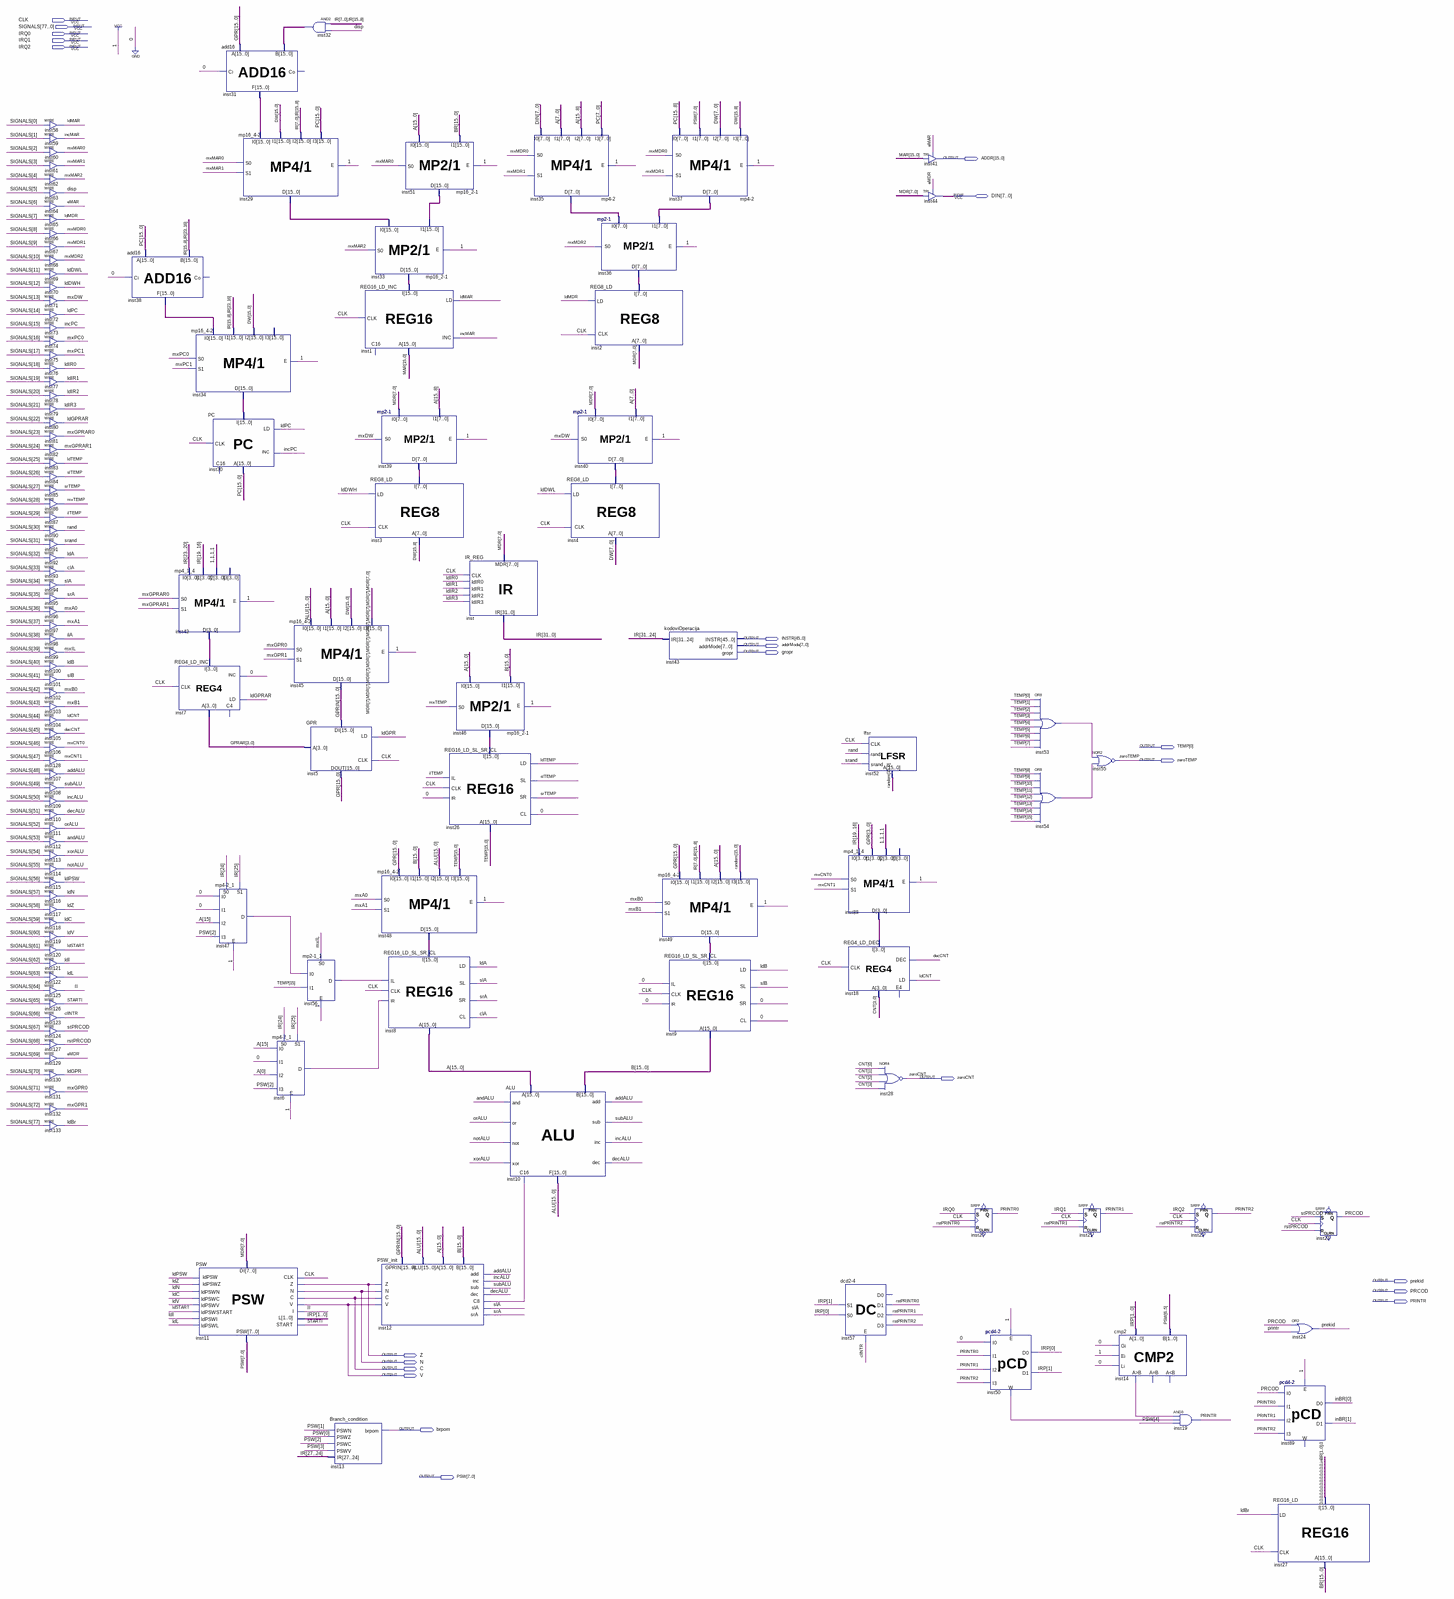
[diagram p0: schematic sheet, whole]
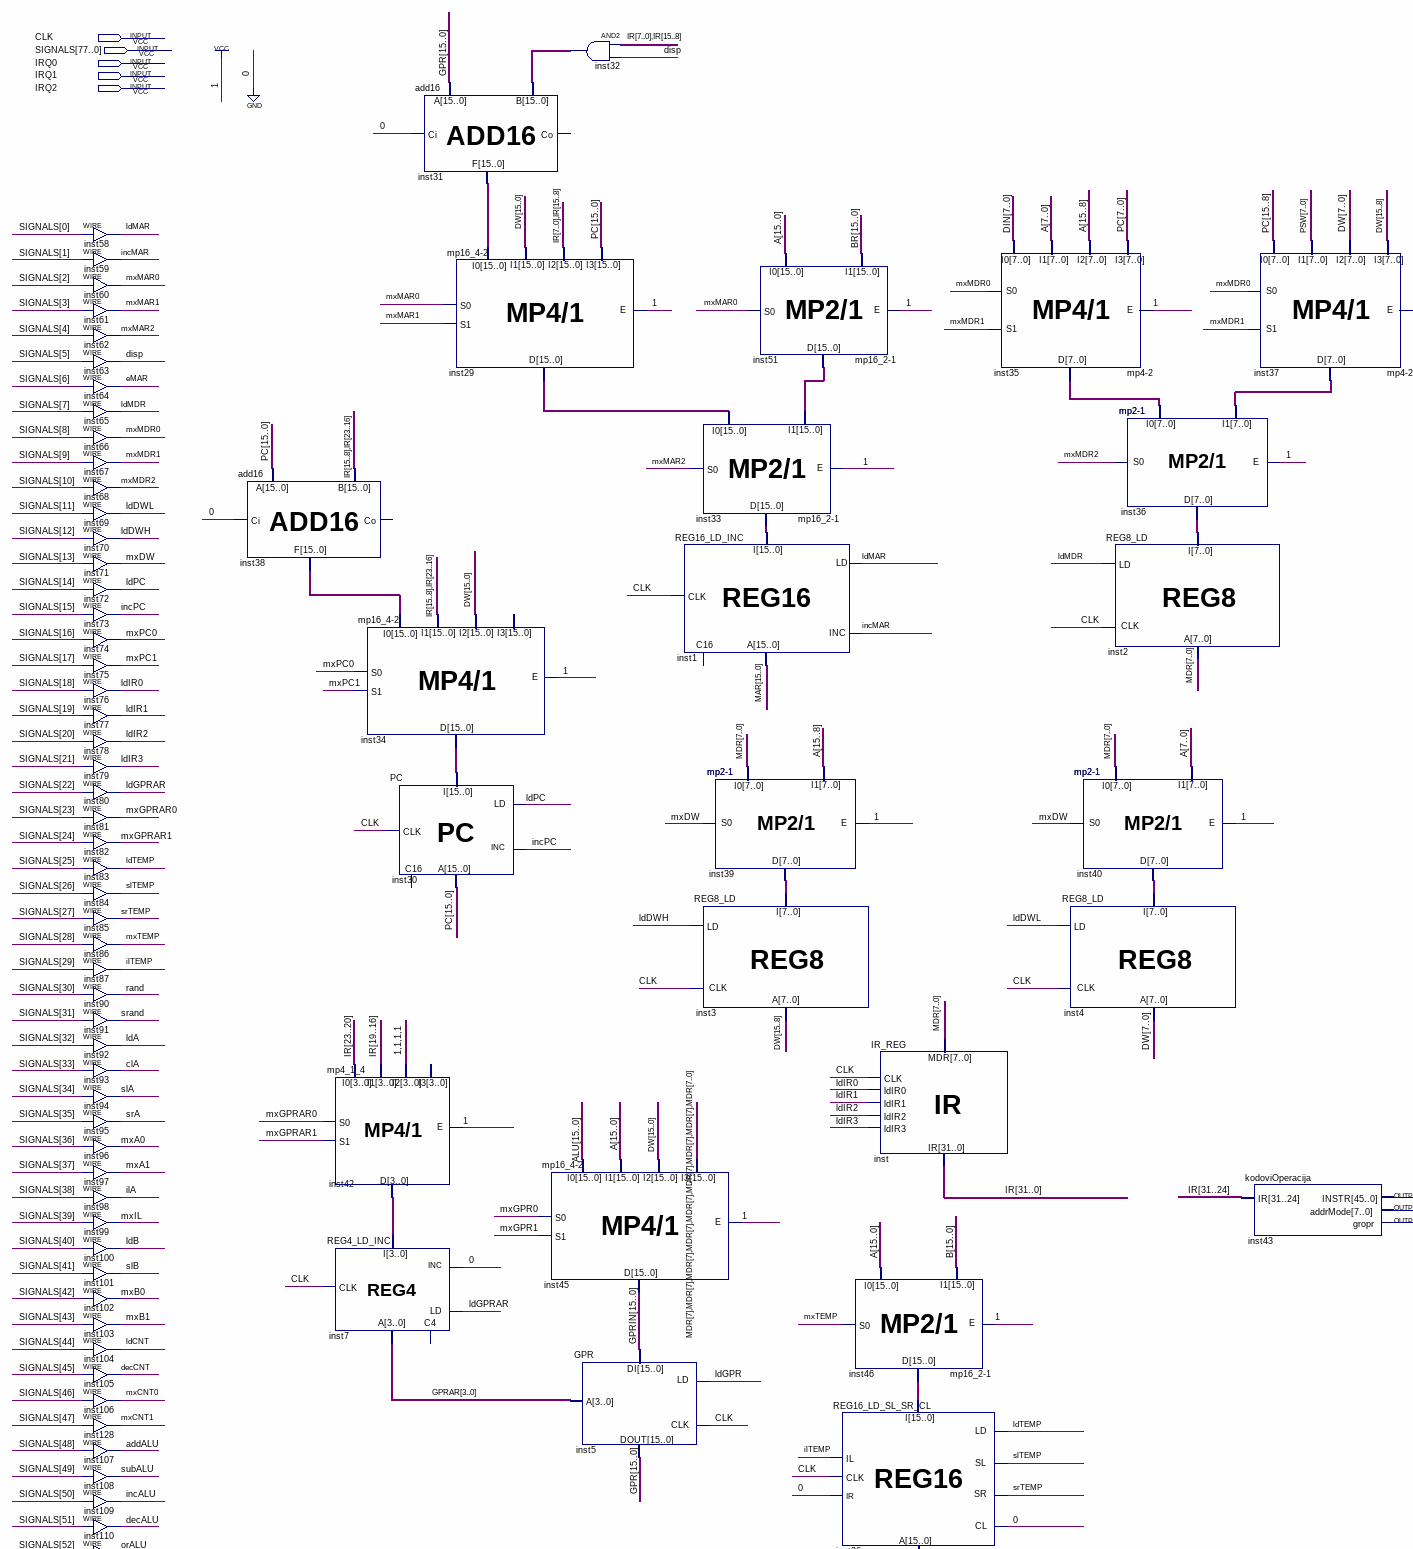
[diagram p1: schematic sheet, upper left part]
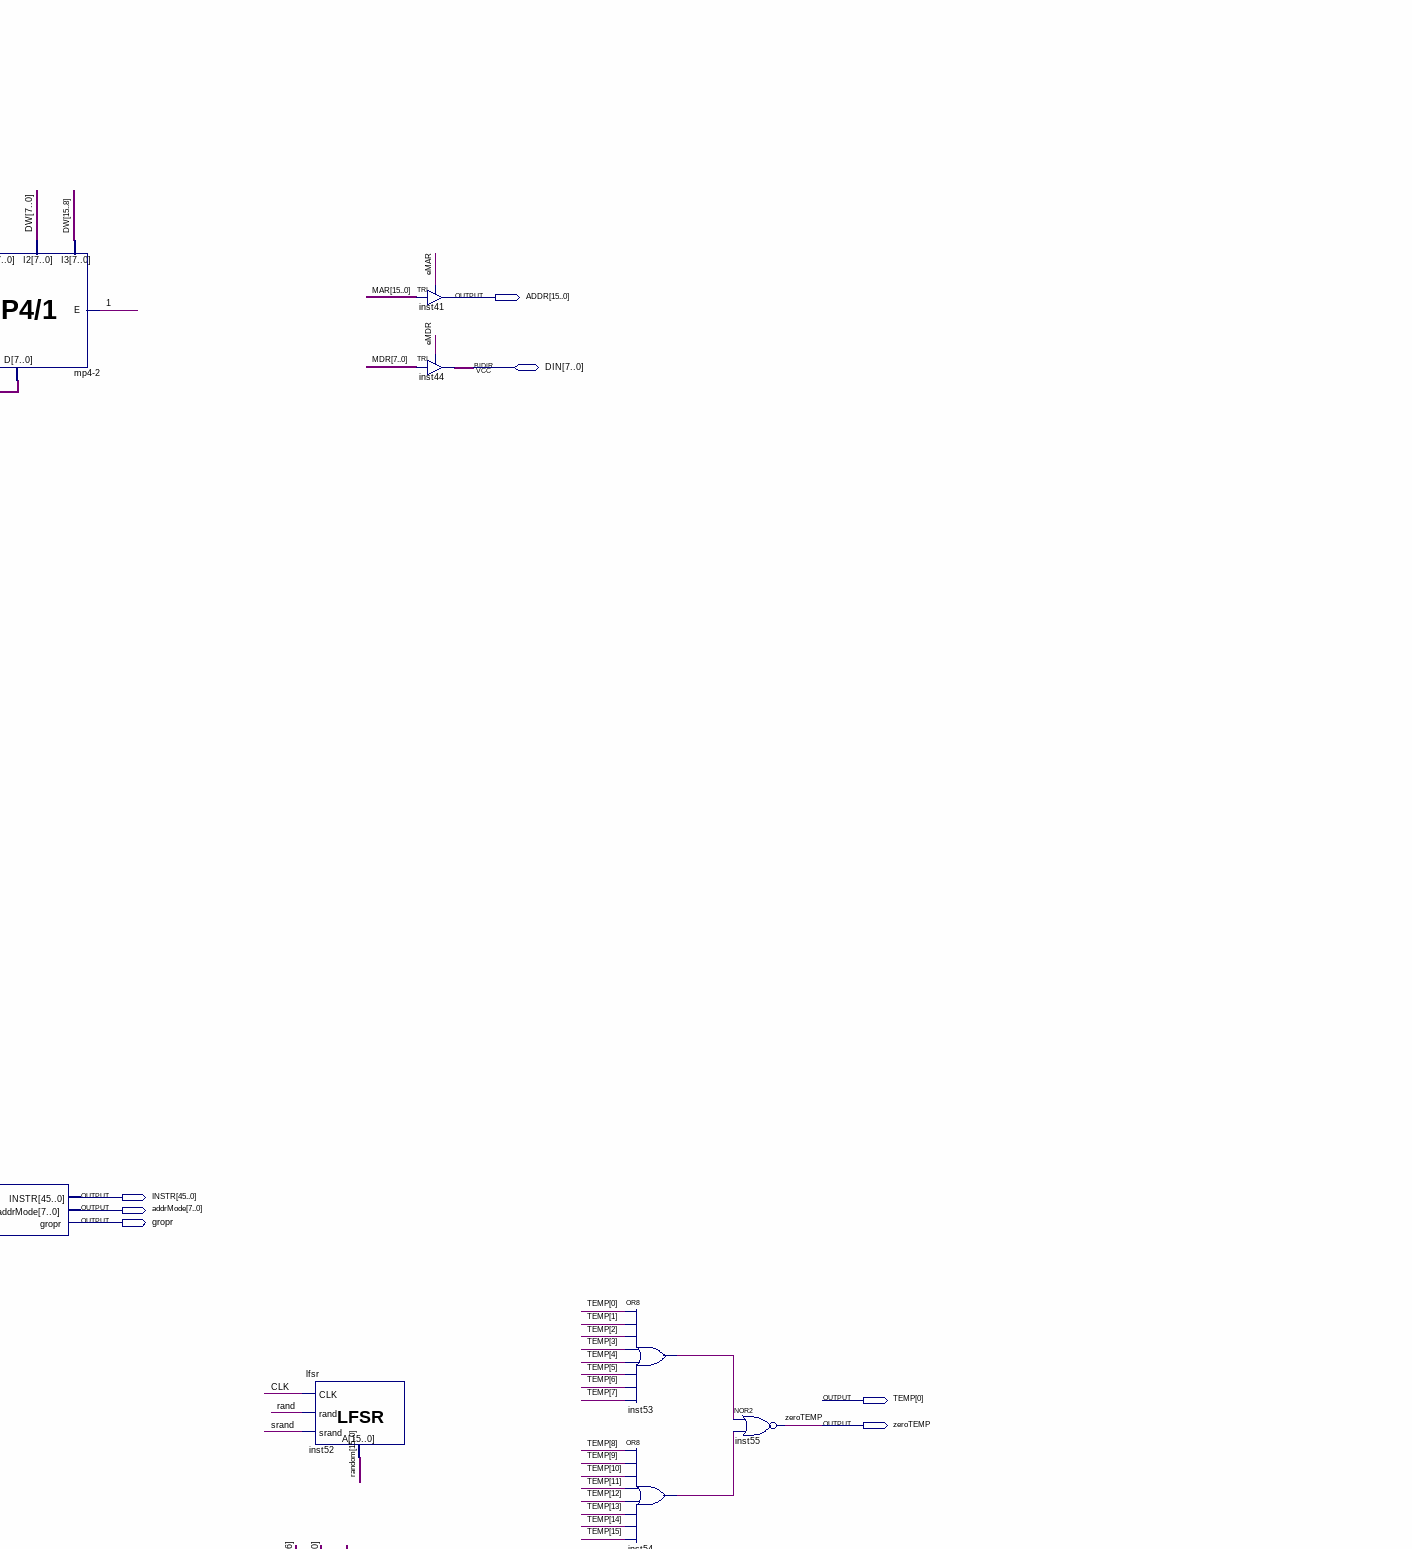
[diagram p2: schematic sheet, upper right part]
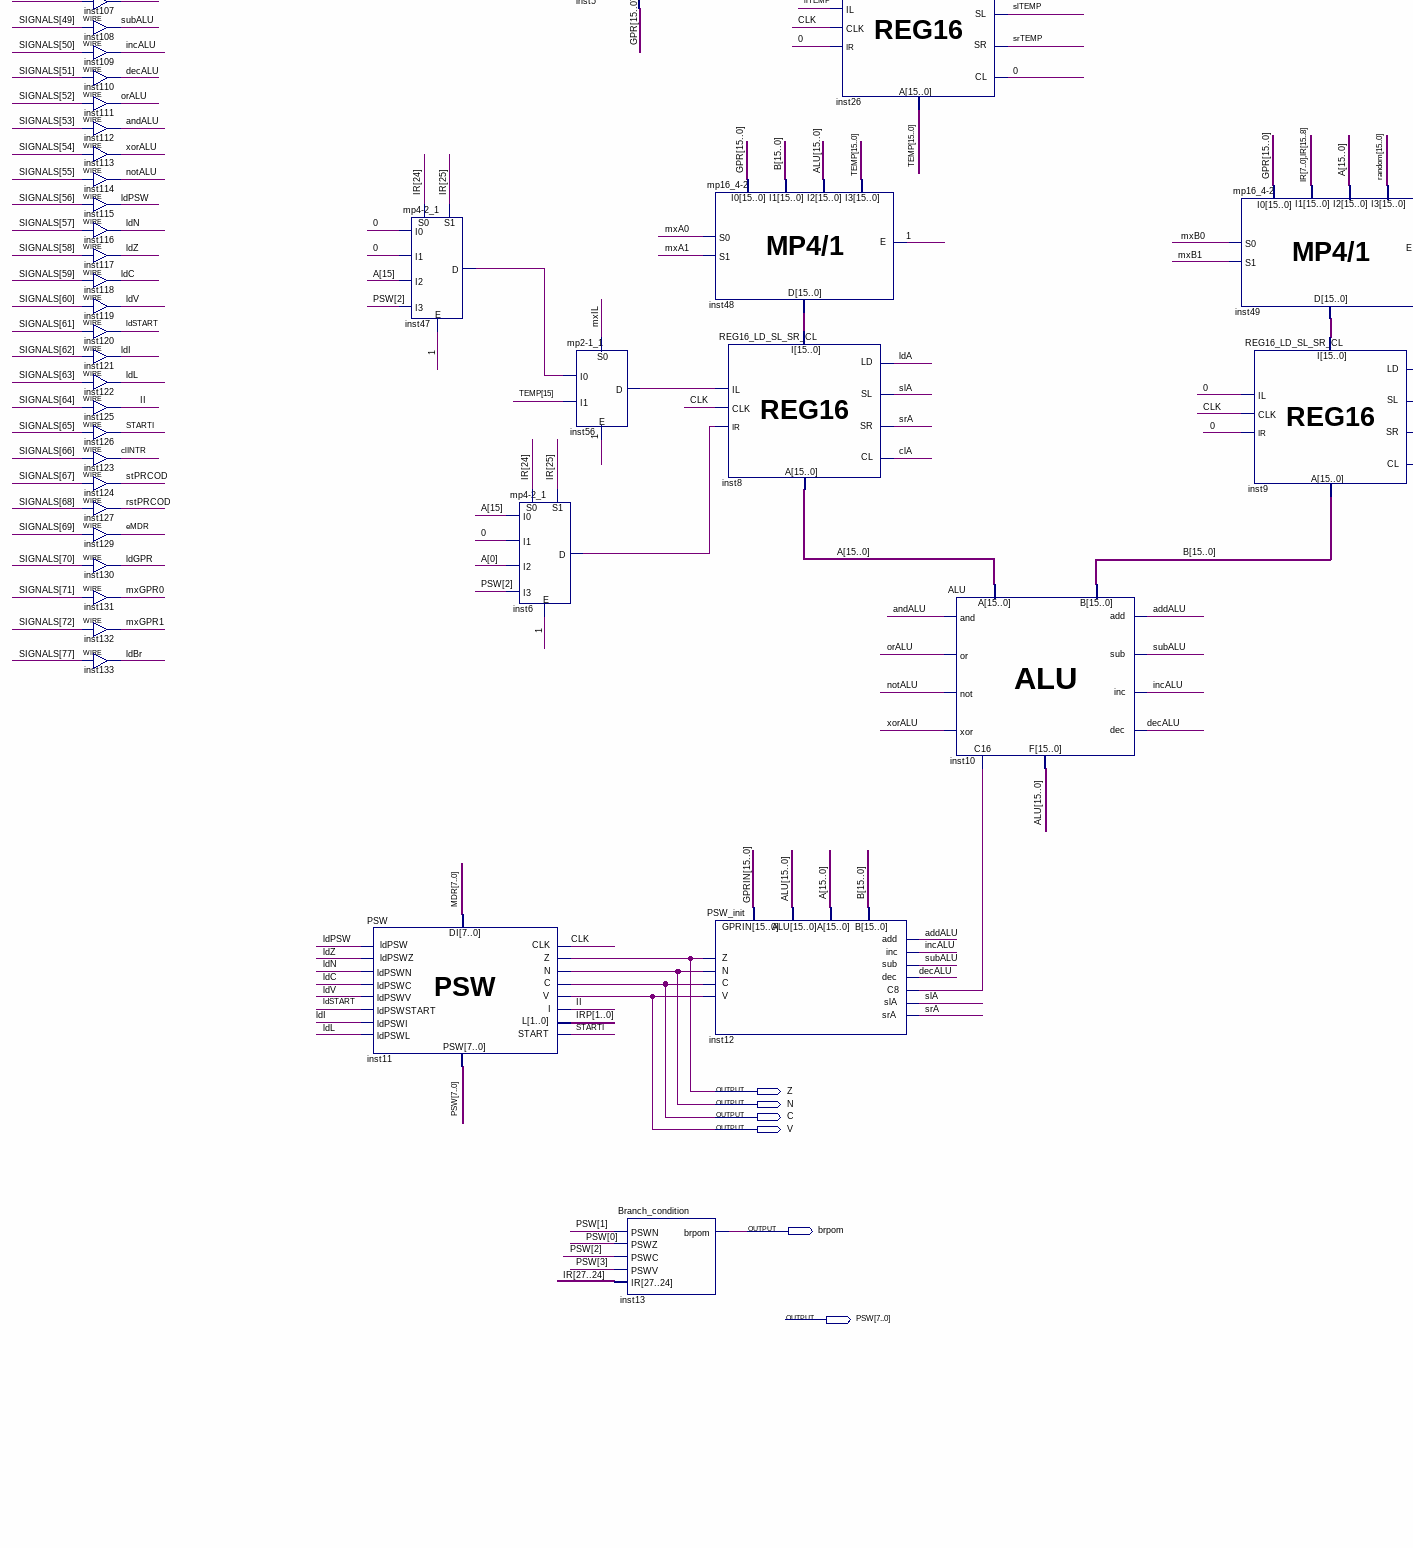
[diagram p3: schematic sheet, lower left part]
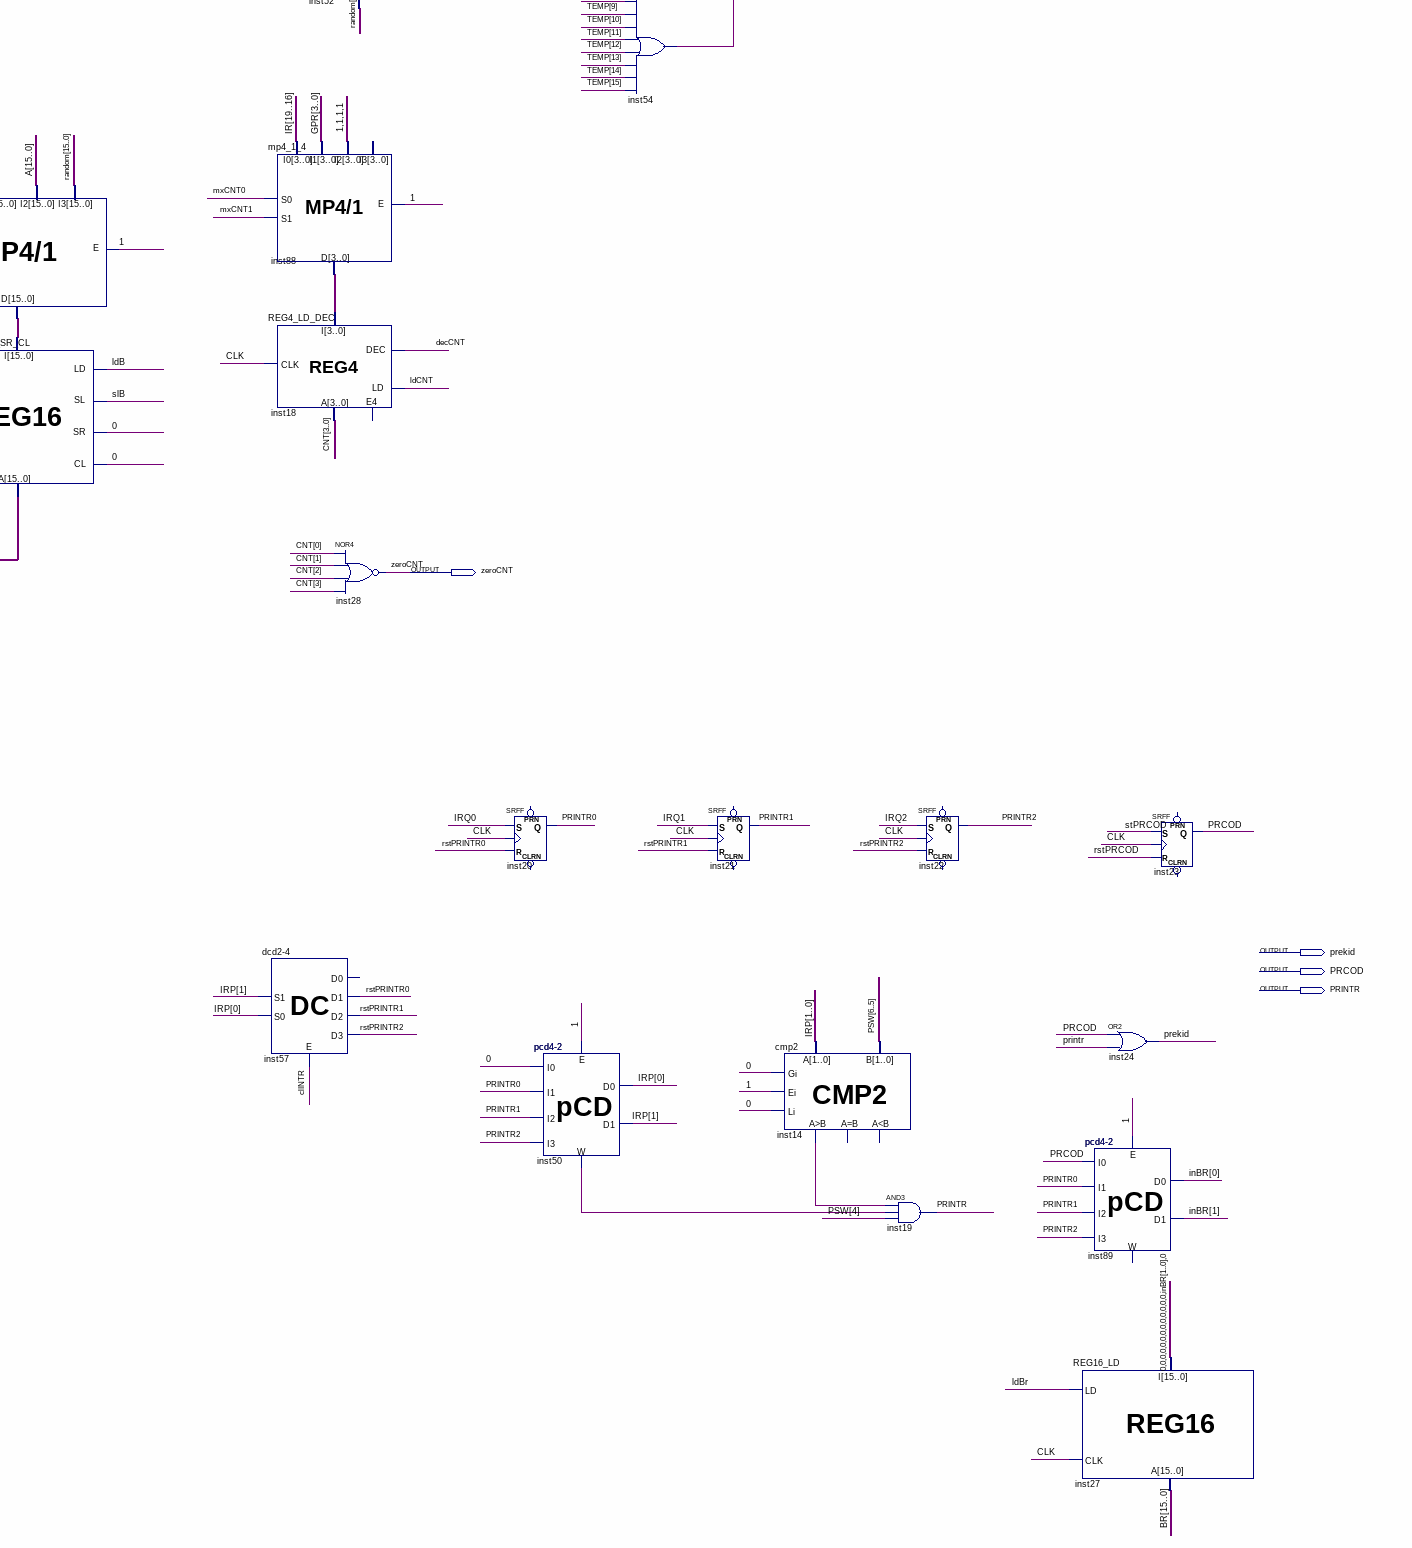
[diagram p4: schematic sheet, lower right part]
// Quartus schematic OP_unit.bdf as structural Verilog: 130 symbols, 22 pins
module OP_unit (
  input  CLK,
  input  [77:0] SIGNALS,
  input  IRQ0,
  input  IRQ1,
  input  IRQ2,
  inout  [7:0] DIN,
  output [15:0] ADDR,
  output [45:0] INSTR,
  output [7:0] addrMode,
  output gropr,
  output [15:0] TEMP,
  output zeroTEMP,
  output zeroCNT,
  output prekid,
  output PRCOD,
  output PRINTR,
  output Z,
  output N,
  output C,
  output V,
  output brpom,
  output [7:0] PSW
);

  wire addALU, andALU, clA, clINTR, decALU, decCNT, disp, eMAR, eMDR, II, ilA, ilTEMP, incALU, incMAR, incPC,
       inst6_d, inst10_c16, inst14_gi_1, inst47_d, inst50_w, inst53_out, inst54_out, inst56_d, ldA, ldB,
       ldBr, ldC, ldCNT, ldDWH, ldDWL, ldGPR, ldGPRAR, ldI, ldIR0, ldIR1, ldIR2, ldIR3, ldL, ldMAR, ldMDR,
       ldN, ldPC, ldPSW, ldSTART, ldTEMP, ldV, ldZ, mxA0, mxA1, mxB0, mxB1, mxCNT0, mxCNT1, mxDW, mxGPR0,
       mxGPR1, mxGPRAR0, mxGPRAR1, mxIL, mxMAR0, mxMAR1, mxMAR2, mxMDR0, mxMDR1, mxMDR2, mxPC0, mxPC1,
       mxTEMP, notALU, orALU, PRINTR0, PRINTR1, PRINTR2, \rand , rstPRCOD, rstPRINTR0, rstPRINTR1,
       rstPRINTR2, slA, slB, slTEMP, srA, srand, srTEMP, STARTI, stPRCOD, subALU, xorALU;
  wire [1:0] inBR, IRP;
  wire [3:0] CNT, GPRAR, inst42_d, inst88_d;
  wire [7:0] inst35_d, inst36_d, inst37_d, inst39_d, inst40_d, MDR;
  wire [15:0] A, ALU, B, BR, DW, GPR, GPRIN, inst29_d, inst31_f, inst32_out, inst33_d, inst34_d, inst38_f,
       inst46_d, inst48_d, inst49_d, inst51_d, MAR, PC, random;
  wire [31:0] IR;

  assign ldMAR = SIGNALS[0];  // WIRE inst58
  assign incMAR = SIGNALS[1];  // WIRE inst59
  assign mxMAR0 = SIGNALS[2];  // WIRE inst60
  assign mxMAR1 = SIGNALS[3];  // WIRE inst61
  assign mxMAR2 = SIGNALS[4];  // WIRE inst62
  assign disp = SIGNALS[5];  // WIRE inst63
  assign eMAR = SIGNALS[6];  // WIRE inst64
  assign ldMDR = SIGNALS[7];  // WIRE inst65
  assign mxMDR0 = SIGNALS[8];  // WIRE inst66
  assign mxMDR1 = SIGNALS[9];  // WIRE inst67
  assign mxMDR2 = SIGNALS[10];  // WIRE inst68
  assign ldDWL = SIGNALS[11];  // WIRE inst69
  assign ldDWH = SIGNALS[12];  // WIRE inst70
  assign mxDW = SIGNALS[13];  // WIRE inst71
  assign ldPC = SIGNALS[14];  // WIRE inst72
  assign incPC = SIGNALS[15];  // WIRE inst73
  assign mxPC0 = SIGNALS[16];  // WIRE inst74
  assign mxPC1 = SIGNALS[17];  // WIRE inst75
  assign ldIR0 = SIGNALS[18];  // WIRE inst76
  assign ldIR1 = SIGNALS[19];  // WIRE inst77
  assign ldIR2 = SIGNALS[20];  // WIRE inst78
  assign ldIR3 = SIGNALS[21];  // WIRE inst79
  assign ldGPRAR = SIGNALS[22];  // WIRE inst80
  assign mxGPRAR0 = SIGNALS[23];  // WIRE inst81
  assign mxGPRAR1 = SIGNALS[24];  // WIRE inst82
  assign ldTEMP = SIGNALS[25];  // WIRE inst83
  assign slTEMP = SIGNALS[26];  // WIRE inst84
  assign srTEMP = SIGNALS[27];  // WIRE inst85
  assign mxTEMP = SIGNALS[28];  // WIRE inst86
  assign ilTEMP = SIGNALS[29];  // WIRE inst87
  assign \rand  = SIGNALS[30];  // WIRE inst90
  assign srand = SIGNALS[31];  // WIRE inst91
  assign ldA = SIGNALS[32];  // WIRE inst92
  assign clA = SIGNALS[33];  // WIRE inst93
  assign slA = SIGNALS[34];  // WIRE inst94
  assign srA = SIGNALS[35];  // WIRE inst95
  assign mxA0 = SIGNALS[36];  // WIRE inst96
  assign mxA1 = SIGNALS[37];  // WIRE inst97
  assign ilA = SIGNALS[38];  // WIRE inst98
  assign mxIL = SIGNALS[39];  // WIRE inst99
  assign ldB = SIGNALS[40];  // WIRE inst100
  assign slB = SIGNALS[41];  // WIRE inst101
  assign mxB0 = SIGNALS[42];  // WIRE inst102
  assign mxB1 = SIGNALS[43];  // WIRE inst103
  assign ldCNT = SIGNALS[44];  // WIRE inst104
  assign decCNT = SIGNALS[45];  // WIRE inst105
  assign mxCNT0 = SIGNALS[46];  // WIRE inst106
  assign mxCNT1 = SIGNALS[47];  // WIRE inst128
  assign addALU = SIGNALS[48];  // WIRE inst107
  assign subALU = SIGNALS[49];  // WIRE inst108
  assign incALU = SIGNALS[50];  // WIRE inst109
  assign decALU = SIGNALS[51];  // WIRE inst110
  assign orALU = SIGNALS[52];  // WIRE inst111
  assign andALU = SIGNALS[53];  // WIRE inst112
  assign xorALU = SIGNALS[54];  // WIRE inst113
  assign notALU = SIGNALS[55];  // WIRE inst114
  assign ldPSW = SIGNALS[56];  // WIRE inst115
  assign ldN = SIGNALS[57];  // WIRE inst116
  assign ldZ = SIGNALS[58];  // WIRE inst117
  assign ldC = SIGNALS[59];  // WIRE inst118
  assign ldV = SIGNALS[60];  // WIRE inst119
  assign ldSTART = SIGNALS[61];  // WIRE inst120
  assign ldI = SIGNALS[62];  // WIRE inst121
  assign ldL = SIGNALS[63];  // WIRE inst122
  assign II = SIGNALS[64];  // WIRE inst125
  assign STARTI = SIGNALS[65];  // WIRE inst126
  assign clINTR = SIGNALS[66];  // WIRE inst123
  assign stPRCOD = SIGNALS[67];  // WIRE inst124
  assign rstPRCOD = SIGNALS[68];  // WIRE inst127
  assign eMDR = SIGNALS[69];  // WIRE inst129
  assign ldGPR = SIGNALS[70];  // WIRE inst130
  assign mxGPR0 = SIGNALS[71];  // WIRE inst131
  assign mxGPR1 = SIGNALS[72];  // WIRE inst132
  assign ldBr = SIGNALS[77];  // WIRE inst133
  add16 inst38 (.A(PC), .B({IR[15:8], IR[23:16]}), .Ci(1'b0), .F(inst38_f));  // open: Co
  \mp16_4-2  inst34 (
    .E(1'b1), .I0(inst38_f), .I1({IR[15:8], IR[23:16]}), .I2(DW), .S0(mxPC0), .S1(mxPC1), .D(inst34_d));  // open: I3
  mp4_1_4 inst42 (
    .E(1'b1), .S0(mxGPRAR0), .S1(mxGPRAR1), .I0(IR[23:20]), .I1(IR[19:16]), .I2(4'b1111), .D(inst42_d));  // open: I3
  REG4_LD_INC inst7 (.LD(ldGPRAR), .INC(1'b0), .CLK(CLK), .I(inst42_d), .A(GPRAR));  // open: C4
  PSW inst11 (
    .CLK(CLK), .DI(MDR), .ldPSW(ldPSW), .ldPSWZ(ldZ), .Z(Z), .ldPSWN(ldN), .N(N), .ldPSWC(ldC), .C(C),
    .ldPSWV(ldV), .V(V), .ldPSWSTART(ldSTART), .START(STARTI), .ldPSWI(ldI), .I(II), .ldPSWL(ldL), .L(IRP),
    .PSW(PSW));
  add16 inst31 (.A(GPR), .B(inst32_out), .Ci(1'b0), .F(inst31_f));  // open: Co
  PC inst30 (.I(inst34_d), .CLK(CLK), .LD(ldPC), .INC(incPC), .A(PC));  // open: C16
  \mp4-2_1  inst47 (.E(1'b1), .I0(1'b0), .I1(1'b0), .I2(A[15]), .I3(PSW[2]), .S0(IR[24]), .S1(IR[25]), .D(inst47_d));
  \mp16_4-2  inst29 (
    .E(1'b1), .I0(inst31_f), .I1(DW), .I2({IR[7:0], IR[15:8]}), .I3(PC), .S0(mxMAR0), .S1(mxMAR1),
    .D(inst29_d));
  \mp4-2_1  inst6 (.E(1'b1), .I0(A[15]), .I1(1'b0), .I2(A[0]), .I3(PSW[2]), .S0(IR[24]), .S1(IR[25]), .D(inst6_d));
  \mp16_4-2  inst45 (
    .E(1'b1), .I0(ALU), .I1(A), .I2(DW), .I3({{9{MDR[7]}}, MDR[6:0]}), .S0(mxGPR0), .S1(mxGPR1), .D(GPRIN));
  \mp2-1_1  inst56 (.E(1'b1), .I0(inst47_d), .I1(TEMP[15]), .S0(mxIL), .D(inst56_d));
  assign inst32_out = {IR[7:0], IR[15:8]} & {16{disp}};  // AND2 inst32, 16 bits wide
  GPR inst5 (.A(GPRAR), .DI(GPRIN), .LD(ldGPR), .CLK(CLK), .DOUT(GPR));
  Branch_condition inst13 (.PSWN(PSW[1]), .PSWZ(PSW[0]), .PSWC(PSW[2]), .PSWV(PSW[3]), .IR(IR[27:24]), .brpom(brpom));
  \mp16_2-1  inst33 (.E(1'b1), .I0(inst29_d), .I1(inst51_d), .S0(mxMAR2), .D(inst33_d));
  REG16_LD_INC inst1 (.I(inst33_d), .CLK(CLK), .LD(ldMAR), .INC(incMAR), .A(MAR));  // open: C16
  \mp2-1  inst39 (.E(1'b1), .S0(mxDW), .I0(MDR), .I1(A[15:8]), .D(inst39_d));
  REG8_LD inst3 (.I(inst39_d), .CLK(CLK), .LD(ldDWH), .A(DW[15:8]));
  \mp16_4-2  inst48 (.E(1'b1), .I0(GPR), .I1(B), .I2(ALU), .I3(TEMP), .S0(mxA0), .S1(mxA1), .D(inst48_d));
  REG16_LD_SL_SR_CL inst8 (
    .CLK(CLK), .LD(ldA), .CL(clA), .SL(slA), .SR(srA), .I(inst48_d), .IL(inst56_d), .IR(inst6_d), .A(A));
  PSW_init inst12 (
    .GPRIN(GPRIN), .ALU(ALU), .A(A), .B(B), .add(addALU), .inc(incALU), .sub(subALU), .dec(decALU),
    .C8(inst10_c16), .slA(slA), .srA(srA), .N(N), .Z(Z), .C(C), .V(V));
  \mp16_2-1  inst51 (.E(1'b1), .I0(A), .I1(BR), .S0(mxMAR0), .D(inst51_d));
  IR_REG inst (.CLK(CLK), .MDR(MDR), .ldIR0(ldIR0), .ldIR1(ldIR1), .ldIR2(ldIR2), .ldIR3(ldIR3), .IR(IR));
  \mp16_2-1  inst46 (.E(1'b1), .I0(A), .I1(B), .S0(mxTEMP), .D(inst46_d));
  REG16_LD_SL_SR_CL inst26 (
    .CLK(CLK), .LD(ldTEMP), .CL(1'b0), .SL(slTEMP), .SR(srTEMP), .I(inst46_d), .IL(ilTEMP), .IR(1'b0),
    .A(TEMP));
  ALU inst10 (
    .A(A), .B(B), .add(addALU), .sub(subALU), .inc(incALU), .dec(decALU), .\and (andALU), .\or (orALU),
    .\not (notALU), .\xor (xorALU), .C16(inst10_c16), .F(ALU));
  \mp4-2  inst35 (.E(1'b1), .S0(mxMDR0), .S1(mxMDR1), .I0(DIN), .I1(A[7:0]), .I2(A[15:8]), .I3(PC[7:0]), .D(inst35_d));
  \mp2-1  inst40 (.E(1'b1), .S0(mxDW), .I0(MDR), .I1(A[7:0]), .D(inst40_d));
  REG8_LD inst4 (.I(inst40_d), .CLK(CLK), .LD(ldDWL), .A(DW[7:0]));
  \mp2-1  inst36 (.E(1'b1), .S0(mxMDR2), .I0(inst35_d), .I1(inst37_d), .D(inst36_d));
  REG8_LD inst2 (.I(inst36_d), .CLK(CLK), .LD(ldMDR), .A(MDR));
  \mp4-2  inst37 (
    .E(1'b1), .S0(mxMDR0), .S1(mxMDR1), .I0(PC[15:8]), .I1(PSW), .I2(DW[7:0]), .I3(DW[15:8]), .D(inst37_d));
  kodoviOperacija inst43 (.IR(IR[31:24]), .INSTR(INSTR), .addrMode(addrMode), .gropr(gropr));
  \mp16_4-2  inst49 (
    .E(1'b1), .I0(GPR), .I1({IR[7:0], IR[15:8]}), .I2(A), .I3(random), .S0(mxB0), .S1(mxB1), .D(inst49_d));
  REG16_LD_SL_SR_CL inst9 (
    .CLK(CLK), .LD(ldB), .CL(1'b0), .SL(slB), .SR(1'b0), .I(inst49_d), .IL(1'b0), .IR(1'b0), .A(B));
  mp4_1_4 inst88 (
    .E(1'b1), .S0(mxCNT0), .S1(mxCNT1), .I0(IR[19:16]), .I1(GPR[3:0]), .I2(4'b1111), .D(inst88_d));  // open: I3
  REG4_LD_DEC inst18 (.LD(ldCNT), .DEC(decCNT), .CLK(CLK), .I(inst88_d), .A(CNT));  // open: E4
  \dcd2-4  inst57 (
    .E(clINTR), .S1(IRP[1]), .S0(IRP[0]), .D1(rstPRINTR0), .D2(rstPRINTR1), .D3(rstPRINTR2));  // open: D0
  lfsr inst52 (.CLK(CLK), .\rand (\rand ), .srand(srand), .A(random));
  nor inst28 (zeroCNT, CNT[0], CNT[1], CNT[2], CNT[3]);
  TRI inst41[15:0] (.IN(MAR), .OE(eMAR), .OUT(ADDR));
  TRI inst44[7:0] (.IN(MDR), .OE(eMDR), .OUT(DIN));
  SRFF inst20 (.S(IRQ0), .R(rstPRINTR0), .CLK(CLK), .Q(PRINTR0));  // open: PRN, CLRN
  \pcd4-2  inst50 (
    .E(1'b1), .I0(1'b0), .I1(PRINTR0), .I2(PRINTR1), .I3(PRINTR2), .D1(IRP[1]), .D0(IRP[0]), .W(inst50_w));
  or inst53 (inst53_out, TEMP[0], TEMP[1], TEMP[2], TEMP[3], TEMP[4], TEMP[5], TEMP[6], TEMP[7]);
  or inst54 (inst54_out, TEMP[8], TEMP[9], TEMP[10], TEMP[11], TEMP[12], TEMP[13], TEMP[14], TEMP[15]);
  SRFF inst21 (.S(IRQ1), .R(rstPRINTR1), .CLK(CLK), .Q(PRINTR1));  // open: PRN, CLRN
  nor inst55 (zeroTEMP, inst53_out, inst54_out);
  cmp2 inst14 (.A(IRP), .B(PSW[6:5]), .Gi(1'b0), .Ei(1'b1), .Li(1'b0), .Gi_1(inst14_gi_1));  // open: Ei_1, Li_1
  SRFF inst22 (.S(IRQ2), .R(rstPRINTR2), .CLK(CLK), .Q(PRINTR2));  // open: PRN, CLRN
  and inst19 (PRINTR, inst14_gi_1, inst50_w, PSW[4]);
  REG16_LD inst27 (.I({{13{1'b0}}, inBR, 1'b0}), .CLK(CLK), .LD(ldBr), .A(BR));
  or inst24 (prekid, PRCOD, PRINTR);
  \pcd4-2  inst89 (
    .E(1'b1), .I0(PRCOD), .I1(PRINTR0), .I2(PRINTR1), .I3(PRINTR2), .D1(inBR[1]), .D0(inBR[0]));  // open: W
  SRFF inst23 (.S(stPRCOD), .R(rstPRCOD), .CLK(CLK), .Q(PRCOD));  // open: PRN, CLRN
endmodule
